# Altium schematic sheet Motor_Driver_r1.1.SchDoc
size A4; DrawnBy: Mat McCann; Organization: Robotics Club; Address1: 3800 Finnerty Rd; Address2: University of Victoria; Address3: Victoria, BC, Canada; Revision: 1.1; SheetNumber: 1; SheetTotal: 1
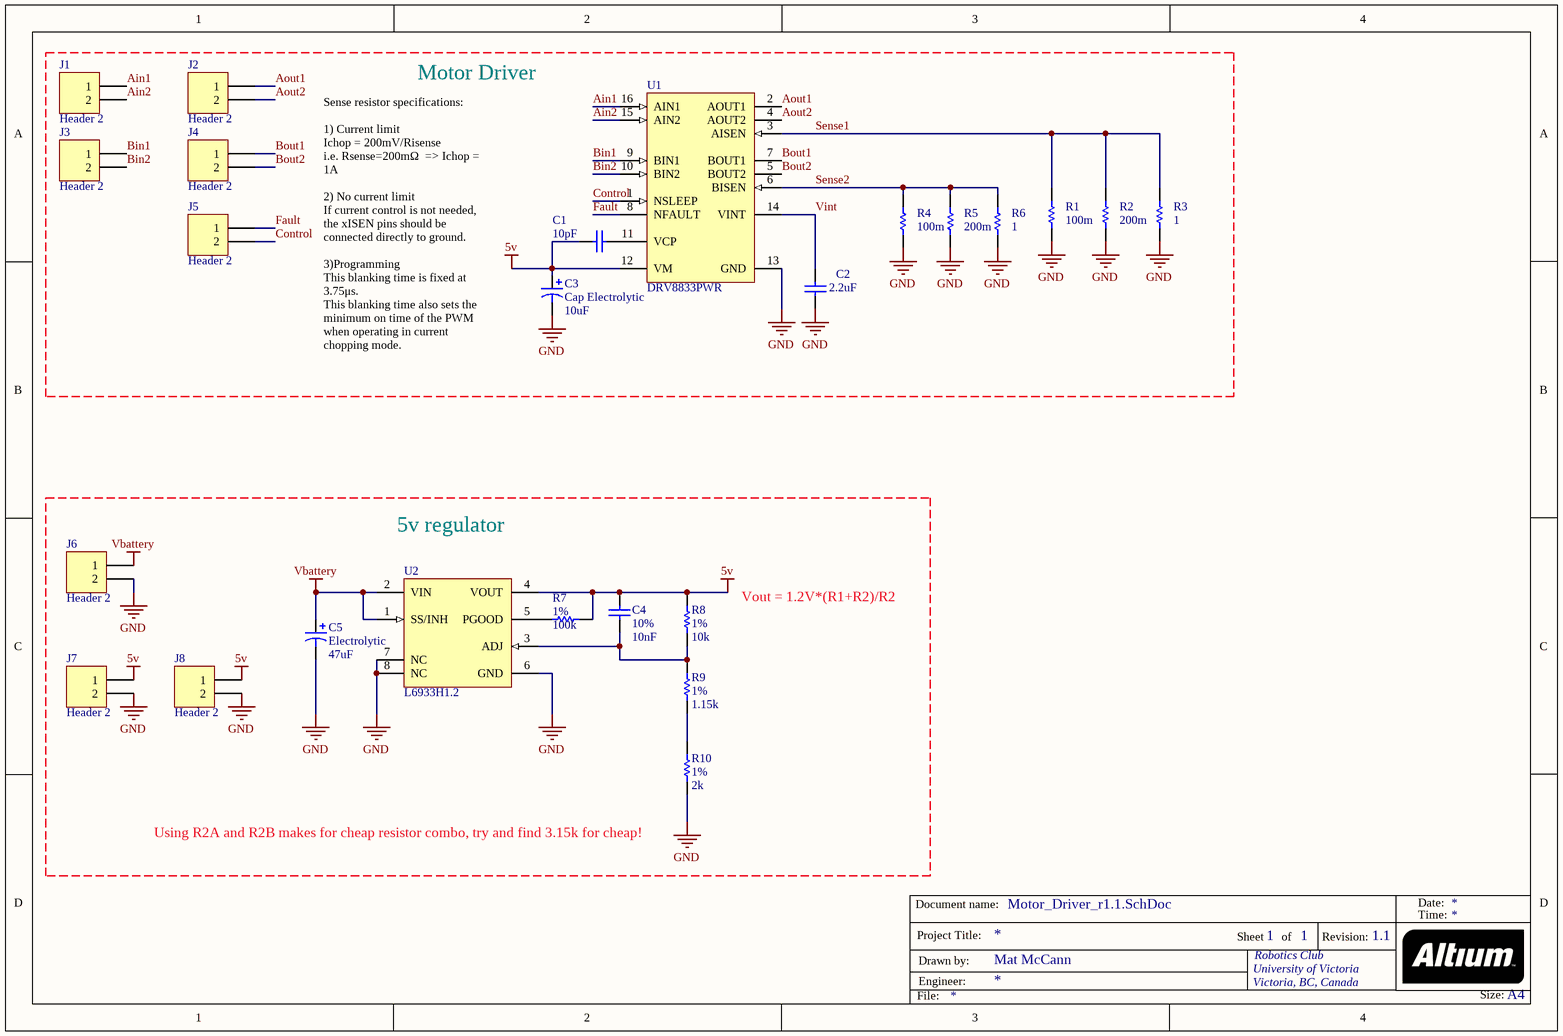
[diagram p0: Motor_Driver_r1.1.SchDoc]

## Parts
C1  value 10pF  [6-0805_M]  (hidden comment: cap)
C2  value 2.2uF  [6-0805_M]  (hidden comment: cap)
C3  Cap Electrolytic  value 10uF  [capacitor_3d]
C4  10%  value 10nF  [6-0805_M]
C5  Electrolytic  value 47uF  [capacitor_tantalum]
J1  Header 2  [HDR1X2]
J2  Header 2  [HDR1X2]
J3  Header 2  [HDR1X2]
J4  Header 2  [HDR1X2]
J5  Header 2  [HDR1X2]
J6  Header 2  [HDR1X2]
J7  Header 2  [HDR1X2]
J8  Header 2  [HDR1X2]
R1  value 100m  [6-0805_M]  (hidden comment: Res1)
R2  value 200m  [6-0805_M]  (hidden comment: Res1)
R3  value 1  [6-0805_M]  (hidden comment: Res1)
R4  value 100m  [6-0805_M]  (hidden comment: Res1)
R5  value 200m  [6-0805_M]  (hidden comment: Res1)
R6  value 1  [6-0805_M]  (hidden comment: Res1)
R7  1%  value 100k  [6-0805_M]
R8  1%  value 10k  [6-0805_M]
R9  1%  value 1.15k  [6-0805_M]
R10  1%  value 2k  [6-0805_M]
U1  DRV8833PWR  [TI-PW16_M]
U2  L6933H1.2  [SO8_M]

## Blocks framed on the sheet
Motor Driver: C1-C3 J1-J5 R1-R6 U1
5v regulator: C4 C5 J6-J8 R7-R10 U2

## Nets
5v: C1.2 C3.1 C4.2 J7.1 J8.1 R7.2 R8.2 U1.12(VM) U2.4(VOUT)
GND: C2.1 C3.2 C5.2 J6.2 J7.2 J8.2 R1.1 R2.1 R3.1 R4.1 R5.1 R6.1 R10.1 U1.13(GND) U2.6(GND) U2.7(NC) U2.8(NC)
Vbattery: C5.1 J6.1 U2.1(SS/INH) U2.2(VIN)
Ain1: J1.1 U1.16(AIN1)
Ain2: J1.2 U1.15(AIN2)
Aout1: J2.1 U1.2(AOUT1)
Aout2: J2.2 U1.4(AOUT2)
Bin1: J3.1 U1.9(BIN1)
Bin2: J3.2 U1.10(BIN2)
Bout1: J4.1 U1.7(BOUT1)
Bout2: J4.2 U1.5(BOUT2)
Control: J5.2 U1.1(NSLEEP)
Fault: J5.1 U1.8(NFAULT)
Sense1: R1.2 R2.2 R3.2 U1.3(AISEN)
Sense2: R4.2 R5.2 R6.2 U1.6(BISEN)
Vint: C2.2 U1.14(VINT)
NetC1_1: C1.1 U1.11(VCP)
NetC4_1: C4.1 R8.1 R9.2 U2.3(ADJ)
NetR7_1: R7.1 U2.5(PGOOD)
NetR9_1: R9.1 R10.2

## Notes on the sheet
- Sense resistor specifications:
  1) Current limit
  Ichop = 200mV/Risense
  i.e. Rsense=200mΩ  => Ichop = 1A
  2) No current limit
  If current control is not needed, the xISEN pins should be connected directly to ground.
  3)Programming
  This blanking time is fixed at 3.75μs.
  This blanking time also sets the minimum on time of the PWM when operating in current chopping mode.
- Vout = 1.2V*(R1+R2)/R2
- (near R10) Using R2A and R2B makes for cheap resistor combo, try and find 3.15k for cheap!
- Document name:
- Date:
- Time:
- Project Title:
- Drawn by:
- Engineer:
- Sheet
- of
- Revision:
- File:
- Size:
- A4

## Library data of the parts
C1 C2 = cap: Capacitor; Published: 8-Jun-2000; LatestRevisionDate: 17-Jul-2002; LatestRevisionNote: Re-released for DXP Platform.; PackageReference: RAD-0.3; Publisher: Altium Limited; PackageDescription: Radial Cap, Thru-Hole; 2 Leads; 0.3 in Pin Spacing; Supplier 1: Digikey
  C1: Supplier Part Number 1: 399-9147-1-ND
  C2: Supplier Part Number 1: 490-3906-1-ND
C3 = Cap Pol1: Polarized Capacitor (Radial); Published: 8-Jun-2000; LatestRevisionDate: 17-Jul-2002; LatestRevisionNote: Re-released for DXP Platform.; PackageReference: RB7.6-15; Publisher: Altium Limited; PackageDescription: Polarized Capacitor (Radial); 2 Leads; Supplier Part Number 1: 493-2099-1-ND; Supplier 1: Digikey
C4 = Cap: Capacitor; manufacture: 885012007016; Published: 8-Jun-2000; LatestRevisionDate: 17-Jul-2002; LatestRevisionNote: Re-released for DXP Platform.; PackageReference: RAD-0.3; Publisher: Altium Limited; PackageDescription: Radial Cap, Thru-Hole; 2 Leads; 0.3 in Pin Spacing; Supplier Part Number 1: 732-7820-1-ND; Supplier 1: digikey
C5 = Cap Pol1: Polarized Capacitor (Radial); manufacture: UPJ1C470MDD1TD; Published: 8-Jun-2000; LatestRevisionDate: 17-Jul-2002; LatestRevisionNote: Re-released for DXP Platform.; PackageReference: RB7.6-15; Publisher: Altium Limited; PackageDescription: Polarized Capacitor (Radial); 2 Leads; Supplier Part Number 1: 493-11373-1-ND; Supplier 1: Digikey
J1-J8 = Header 2: Header, 2-Pin; LatestRevisionDate: 17-Jul-2002; LatestRevisionNote: Re-released for DXP Platform.; Publisher: Altium Limited; Supplier 1: Digikey
  J1-J5: Supplier Part Number 1: A1921-ND
  J6-J8: Supplier Part Number 1: A1971-ND
R1-R6 = Res1: Resistor; Published: 8-Jun-2000; LatestRevisionDate: 17-Jul-2002; LatestRevisionNote: Re-released for DXP Platform.; PackageReference: AXIAL-0.3; Publisher: Altium Limited; PackageDescription: Axial Device, Thru-Hole; 2 Leads; 0.3 in Pin Spacing; Supplier Part Number 1: 73L3R20JCT-ND; Supplier 1: Digikey
R7 = Res1: Resistor; manufacture: RC0805FR-07100KL; Published: 8-Jun-2000; LatestRevisionDate: 17-Jul-2002; LatestRevisionNote: Re-released for DXP Platform.; PackageReference: AXIAL-0.3; Publisher: Altium Limited; PackageDescription: Axial Device, Thru-Hole; 2 Leads; 0.3 in Pin Spacing; Supplier Part Number 1: 311-100KCRCT-ND; Supplier 1: digikey
R8 = Res1: Resistor; manufacture: RC0805FR-0710KL; Published: 8-Jun-2000; LatestRevisionDate: 17-Jul-2002; LatestRevisionNote: Re-released for DXP Platform.; PackageReference: AXIAL-0.3; Publisher: Altium Limited; PackageDescription: Axial Device, Thru-Hole; 2 Leads; 0.3 in Pin Spacing; Supplier Part Number 1: 311-10.0KCRCT-ND; Supplier 1: digikey
R9 = Res1: Resistor; manufacture: RC0805FR-071K15L; Published: 8-Jun-2000; LatestRevisionDate: 17-Jul-2002; LatestRevisionNote: Re-released for DXP Platform.; PackageReference: AXIAL-0.3; Publisher: Altium Limited; PackageDescription: Axial Device, Thru-Hole; 2 Leads; 0.3 in Pin Spacing; Supplier Part Number 1: 311-1.15KCRCT-ND; Supplier 1: Digikey
R10 = Res1: Resistor; manufacture: RC0805FR-072KL; Published: 8-Jun-2000; LatestRevisionDate: 17-Jul-2002; LatestRevisionNote: Re-released for DXP Platform.; PackageReference: AXIAL-0.3; Publisher: Altium Limited; PackageDescription: Axial Device, Thru-Hole; 2 Leads; 0.3 in Pin Spacing; Supplier Part Number 1: 311-2.00KCRCT-ND; Supplier 1: Digikey
U1 = CMP-1529-00001-1: 2 A Low Voltage Dual Brushed DC or Single Bipolar Stepper Motor Driver (PWM Ctrl), 2.7 to 10.8 V, -40 to 85 degC, 16-Pin SOP (PW), Green (RoHS & no Sb/Br), Tape and Reel; Manufacturer: Texas Instruments; Vs: 2.7 V Min.; RMS Output Current: 1.5 A; Peak Output Current: 2 A; rDS (ON) (LS + HS): 360 mOhms; ComponentLink1URL: www.ti.com; Temperature Range: -40 to 85 degC; ComponentLink2Description: Datasheet; PackageVersion: 4040064-4/G; ComponentLink3URL: http://www.ti.com/lit/ml/mpds361/mpds361.pdf; PartNumber: DRV8833PWR; Control I/F: PWM; ComponentLink1Description: Manufacturer URL; ComponentLink3Description: Package Specification; PackageDescription: 16-Pin Plastic Small Outline, Body 4.4 x 5 mm, Pitch 0.65 mm; Mounting Technology: Surface Mount; Eco-Plan: Green (RoHS & no Sb/Br); DatasheetVersion: SLVSAR1D; ComponentLink2URL: http://www.ti.com/lit/ds/symlink/drv8833.pdf; Packing: Tape and Reel; Supplier 1: Digikey; Supplier Part Number 1: 296-40080-1-ND
U2 = CMP-0240-00057-1: High Performance 2A ULDO Linear Regulator with Soft Start, 8-Pin SO; Code_JEDEC: MS-012-AA; PackageReference: SO8; ComponentLink3Description: Package Specification; ComponentLink1Description: Manufacturer URL; ComponentLink2Description: Datasheet; PackageVersion: Dec-2002; DatasheetVersion: Nov-2007; PackageDescription: 8-Pin Small Outline Integrated Circuit 1.27 mm Pitch; Code_IPC: SOIC127P600-8; ComponentLink2URL: http://www.st.com/internet/com/TECHNICAL_RESOURCES/TECHNICAL_LITERATURE/DATASHEET/CD00148469.pdf; ComponentLink1URL: http://www.st.com; ComponentLink3URL: http://www.st.com/internet/com/TECHNICAL_RESOURCES/TECHNICAL_LITERATURE/PACKAGE_INFORMATION/CD00004680.pdf; Supplier Part Number 1: 497-7766-1-ND; Supplier 1: Digikey